# EAGLE design Schematic LED Board (EAGLE 9.2.1)
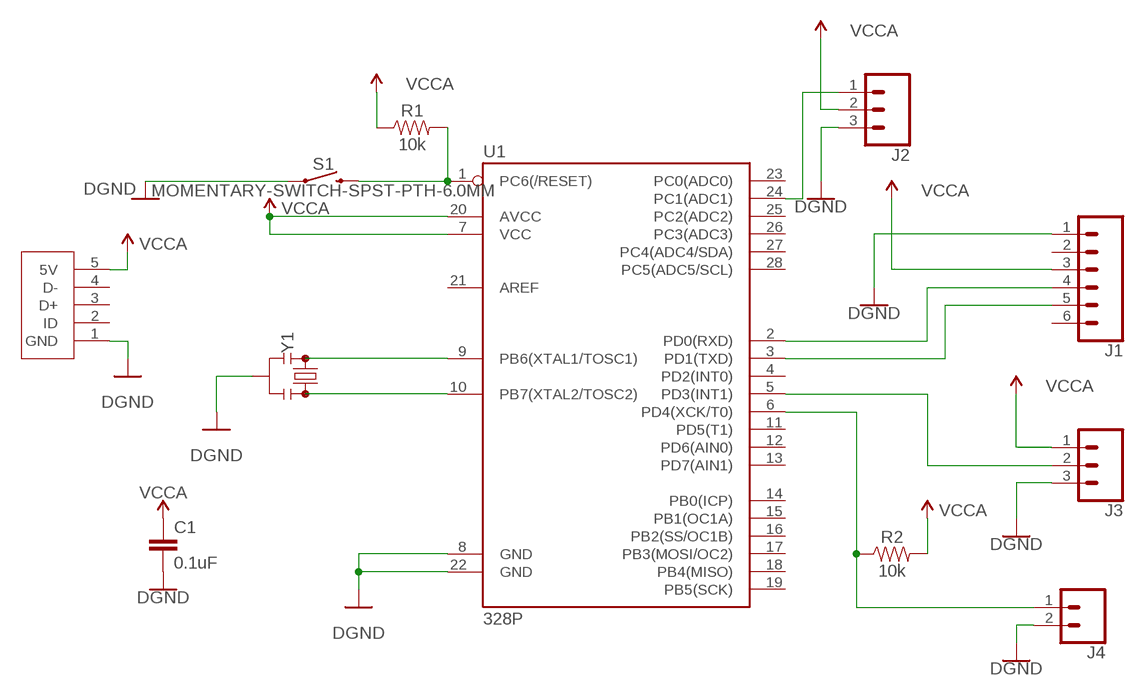
[diagram p0: schematic, sheet 1]

## Parts
C1  0.1uF  0.1UF-KIT-EZ-50V-20%  [CAP-PTH-SMALL-KIT]
J1  CONN_06LONGPADS  [1X06_LONGPADS]
J2  CONN_03LONGPADS  [1X03_LONGPADS]
J3  CONN_03LONGPADS  [1X03_LONGPADS]
J4  CONN_02PTH3  [1X02_LONGPADS]
R1  10k  10KOHM-HORIZ-1/6W-5%  [AXIAL-0.3]
R2  10k  10KOHM-HORIZ-1/6W-5%  [AXIAL-0.3]
S1  MOMENTARY-SWITCH-SPST-PTH-6.0MM  [TACTILE_SWITCH_PTH_6.0MM]
U1  328P  ATMEGA328P_PDIP  [DIP28]
U$8  USBPOWER  [1X05_LONGPADS]
Y1  RESONATORPTH-7.6X3.8  [RESONATOR-PTH-7.6X3.8]

## Nets
GND: C1.2 J1.1 J2.3 J3.3 J4.2 S1.1 U1.8(GND) U1.22(GND) U$8.1(GND) Y1.2 ; supply symbol labelled DGND
N$1: U1.9(PB6(XTAL1/TOSC1)) Y1.1
N$2: R1.P$2 S1.3 U1.1(PC6(/RESET))
N$3: U1.10(PB7(XTAL2/TOSC2)) Y1.3
N$4: J3.2 U1.5(PD3(INT1))
N$5: J1.4 U1.2(PD0(RXD))
N$6: J1.5 U1.3(PD1(TXD))
N$7: J2.1 U1.24(PC1(ADC1))
N$8: J4.1 R2.P$1 U1.6(PD4(XCK/T0))
VCCA: C1.1 J1.3 J2.2 J3.1 R1.P$1 R2.P$2 U1.7(VCC) U1.20(AVCC) U$8.5(5V)
Unconnected: J1.2 J1.6 U1.4(PD2(INT0)) U1.11(PD5(T1)) U1.12(PD6(AIN0)) U1.13(PD7(AIN1)) U1.14(PB0(ICP)) U1.15(PB1(OC1A)) U1.16(PB2(SS/OC1B)) U1.17(PB3(MOSI/OC2)) U1.18(PB4(MISO)) U1.19(PB5(SCK)) U1.21(AREF) U1.23(PC0(ADC0)) U1.25(PC2(ADC2)) U1.26(PC3(ADC3)) U1.27(PC4(ADC4/SDA)) U1.28(PC5(ADC5/SCL)) U$8.2(ID) U$8.3(D+) U$8.4(D-)

## Library data of the parts
C1 = Renata's Library:0.1UF: 0.1µF ceramic capacitors A capacitor is a passive two-terminal electrical component used to store electrical energy temporarily in an electric field.; PROD_ID: CAP-08370
J1 = Renata's Library:CONN_06: Multi connection point. Often used as Generic Header-pin footprint for 0.1 inch spaced/style header connections On any of the 0.1 inch spaced packages, you can populate with these: Break Away Headers - Straight <https://www.sparkfun.com/products/116> (PRT-00116) Break Away Male Headers - Right Angle <https://www.sparkfun.com/products/553> (PRT-00553) Female Headers <https://www.sparkfun.com/products/115> (PRT-00115) Break Away Headers - Machine Pin <https://www.sparkfun.com/products/117> (PRT-00117) Break Away Female Headers - Swiss Machine Pin <https://www.sparkfun.com/products/743> (PRT-00743) Arduino Stackable Header - 6 Pin <https://www.sparkfun.com/products/9280> (PRT-09280) For SCREWTERMINALS and SPRING TERMINALS visit here: Screw Terimnals on SparkFun.com <https://www.sparkfun.com/search/results?term=Screw+Terminals> (5mm/3.5mm/2.54mm spacing) This device is also useful as a general connection point to wire up your design to another part of your project. Our various solder wires solder well into these plated through hole pads. Hook-Up Wire - Assortment (Stranded, 22 AWG) <https://www.sparkfun.com/products/11375> (PRT-11375) Hook-Up Wire - Assortment (Solid Core, 22 AWG) <https://www.sparkfun.com/products/11367> (PRT-11367) View the entire wire category on our website here <https://www.sparkfun.com/categories/141>
J2 J3 = Renata's Library:CONN_03: Multi connection point. Often used as Generic Header-pin footprint for 0.1 inch spaced/style header connections On any of the 0.1 inch spaced packages, you can populate with these: Break Away Headers - Straight <https://www.sparkfun.com/products/116> (PRT-00116) Break Away Male Headers - Right Angle <https://www.sparkfun.com/products/553> (PRT-00553) Female Headers <https://www.sparkfun.com/products/115> (PRT-00115) Break Away Headers - Machine Pin <https://www.sparkfun.com/products/117> (PRT-00117) Break Away Female Headers - Swiss Machine Pin <https://www.sparkfun.com/products/743> (PRT-00743) Stackable Header - 3 Pin (Female, 0.1") <https://www.sparkfun.com/products/13875> (PRT-13875) For SCREWTERMINALS and SPRING TERMINALS visit here: Screw Terimnals on SparkFun.com <https://www.sparkfun.com/search/results?term=Screw+Terminals> (5mm/3.5mm/2.54mm spacing) This device is also useful as a general connection point to wire up your design to another part of your project. Our various solder wires solder well into these plated through hole pads. Hook-Up Wire - Assortment (Stranded, 22 AWG) <https://www.sparkfun.com/products/11375> (PRT-11375) Hook-Up Wire - Assortment (Solid Core, 22 AWG) <https://www.sparkfun.com/products/11367> (PRT-11367) View the entire wire category on our website here <https://www.sparkfun.com/categories/141> Special notes: Molex polarized connector foot print use with SKU : PRT-08232 with associated crimp pins and housings.
J4 = Renata's Library:CONN_02: Multi connection point. Often used as Generic Header-pin footprint for 0.1 inch spaced/style header connections On any of the 0.1 inch spaced packages, you can populate with these: Break Away Headers - Straight <https://www.sparkfun.com/products/116> (PRT-00116) Break Away Male Headers - Right Angle <https://www.sparkfun.com/products/553> (PRT-00553) Female Headers <https://www.sparkfun.com/products/115> (PRT-00115) Break Away Headers - Machine Pin <https://www.sparkfun.com/products/117> (PRT-00117) Break Away Female Headers - Swiss Machine Pin <https://www.sparkfun.com/products/743> (PRT-00743) For SCREWTERMINALS and SPRING TERMINALS visit here: Screw Terimnals on SparkFun.com <https://www.sparkfun.com/search/results?term=Screw+Terminals> (5mm/3.5mm/2.54mm spacing) This device is also useful as a general connection point to wire up your design to another part of your project. Our various solder wires solder well into these plated through hole pads. Hook-Up Wire - Assortment (Stranded, 22 AWG) <https://www.sparkfun.com/products/11375> (PRT-11375) Hook-Up Wire - Assortment (Solid Core, 22 AWG) <https://www.sparkfun.com/products/11367> (PRT-11367) View the entire wire category on our website here <https://www.sparkfun.com/categories/141> Special notes: Molex polarized connector foot print use with: PRT-08233 with associated crimp pins and housings. 2.54_SCREWTERM for use with PRT-10571. 3.5mm Screw Terminal footprints for PRT-08084 5mm Screw Terminal footprints for use with PRT-08432
R1 R2 = Renata's Library:10KOHM: 10kΩ resistor A resistor is a passive two-terminal electrical component that implements electrical resistance as a circuit element. Resistors act to reduce current flow, and, at the same time, act to lower voltage levels within circuits. - Wikipedia; PROD_ID: RES-08375
S1 = Renata's Library:MOMENTARY-SWITCH-SPST: Momentary Switch (Pushbutton) - SPST Normally-open (NO) SPST momentary switches (buttons, pushbuttons). Variants PTH-12MM - 12mm square, through-hole Momentary Pushbutton Switch - 12mm Square <https://www.sparkfun.com/products/9190> (COM-09190) PTH-6.0MM, PTH-6.0MM-KIT - 6.0mm square, through-hole Mini Pushbutton Switch <https://www.sparkfun.com/products/97> (COM-00097) KIT package intended for soldering kit's - only one side of pads' copper is exposed. PTH-RIGHT-ANGLE-KIT - Right-angle, through-hole Right Angle Tactile Button <https://www.sparkfun.com/products/10791> - Used on SparkFun BigTime Watch Kit <https://www.sparkfun.com/products/11734> SMD-12MM - 12mm square, surface-mount Tactile Button - SMD (12mm) <https://www.sparkfun.com/products/12993> (COM-12993) Used on SparkFun PicoBoard <https://www.sparkfun.com/products/11888> SMD-4.5MM - 4.5mm Square Trackball Switch Used on SparkFun Blackberry Trackballer Breakout <https://www.sparkfun.com/products/13169> SMD-4.6MMX2.8MM - 4.60mm x 2.80mm, surface mount Used on SparkFun SAMD21 Mini Breakout <https://www.sparkfun.com/products/13664> SMD-5.2MM, SMD-5.2-REDUNDANT - 5.2mm square, surface-mount Mini Pushbutton Switch - SMD <https://www.sparkfun.com/products/8720> (COM-08720) Used on Arduino Pro Mini <https://www.sparkfun.com/products/11114> REDUNDANT package connects both switch circuits together SMD-6.0X3.5MM - 6.0 x 3.5mm, surface mount Momentary Reset Switch SMD <https://www.sparkfun.com/products/8229> (COM-08229) SMD-6.2MM-TALL - 6.2mm square, surface mount Tactile Button - SMD (6mm) <https://www.sparkfun.com/products/12992> Used on SparkFun Digital Sandbox <https://www.sparkfun.com/products/12651> SMD-RIGHT-ANGLE - Right-angle, surface mount Used on SparkFun Block for Intel® Edison - Arduino <https://www.sparkfun.com/products/13036>; PROD_ID: SWCH-08441; SF_SKU: COM-00097
U1 = Renata's Library:ATMEGA328P_PDIP: Atmel 328P Through hole ATMEGA328P uC used in the Arduino 32kb flash, 1k EEPROM, 2k SRAM Datasheet <http://www.sparkfun.com/datasheets/Components/SMD/ATMega328.pdf> SparkFun Products Storefront component: AVR 28 Pin 20MHz 32K 6A/D - ATMega328P <https://www.sparkfun.com/products/9061> (COM-09061) SparkFun Simon Says - Through-Hole Soldering Kit <https://www.sparkfun.com/products/10547> (KIT-10547) SparkFun Learn to Solder - Simon Says <https://www.sparkfun.com/products/13708> (KIT-13708) SparkFun BigTime Watch Kit <https://www.sparkfun.com/products/11734> (KIT-11734) SparkFun ClockIt <https://www.sparkfun.com/products/10930> (KIT-10930) SparkFun Serial Enabled LCD Kit <https://www.sparkfun.com/products/10097> (LCD-10097) SparkFun Simon Tilts - Through Hole Soldering Kit <https://www.sparkfun.com/products/12634> (KIT-12634) SparkFun Frequency Counter Kit <https://www.sparkfun.com/products/10140> (KIT-10140) FabFM Radio Kit <https://www.sparkfun.com/products/11043> (KIT-11043) SparkFun Binary Blaster Kit <https://www.sparkfun.com/products/12037> (KIT-12037) SparkFun Metro-Gnome <https://www.sparkfun.com/products/9236> (KIT-09236) ATmega328 with Arduino Optiboot (Uno) <https://www.sparkfun.com/products/10524> (DEV-10524); PROD_ID: IC-09136
U$8 = Renata's Library:USBPOWER
Y1 = Renata's Library:RESONATOR: Resonators (Generic) Ceramic resonators are clock-generating components, often used to control timing in microcontrollers. They usually have 3 pins: two pins for oscillation, and one pin for ground. Compared to crystals, resonators have worse tolerance, but are usually much cheaper. Plus, they have built-in load capacitors! These devices are used on boards like the Arduino Pro 8MHz <https://www.sparkfun.com/products/11114> and Arduino Pro 16MHz <https://www.sparkfun.com/products/11113>.

## Net classes
0 default: width 0.457 mm, drill 0.457 mm, clearance 0.457 mm

## Board
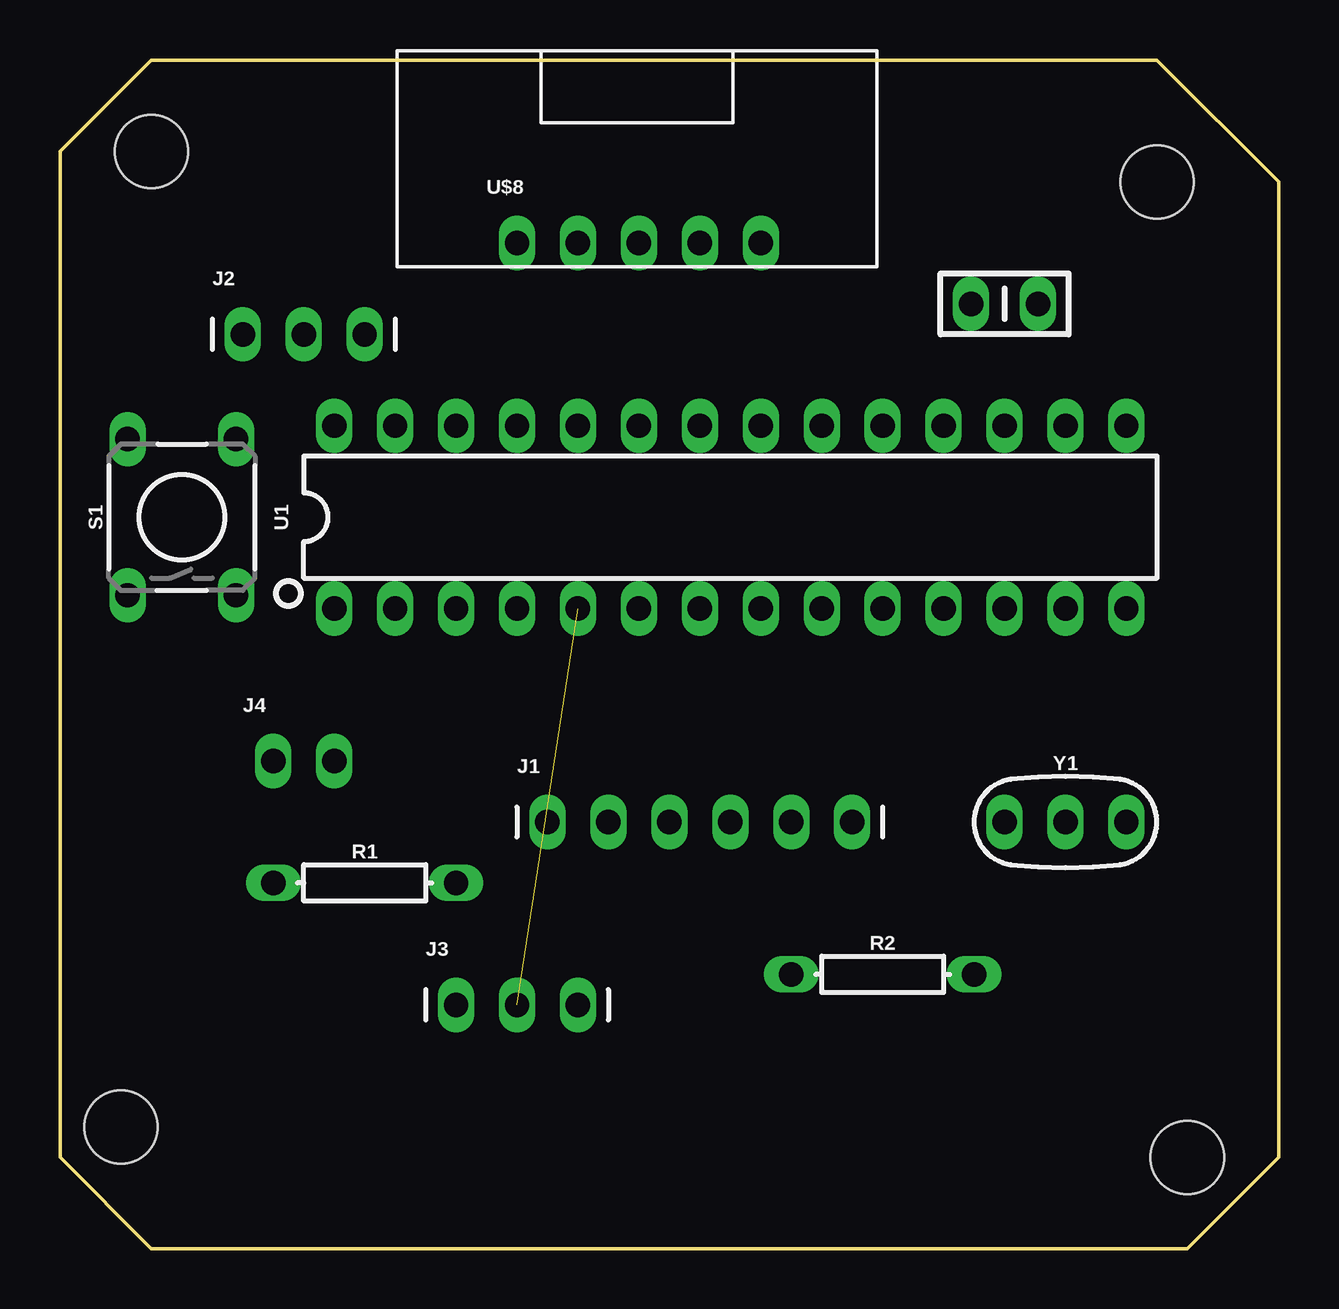
[diagram p1: board, top side]
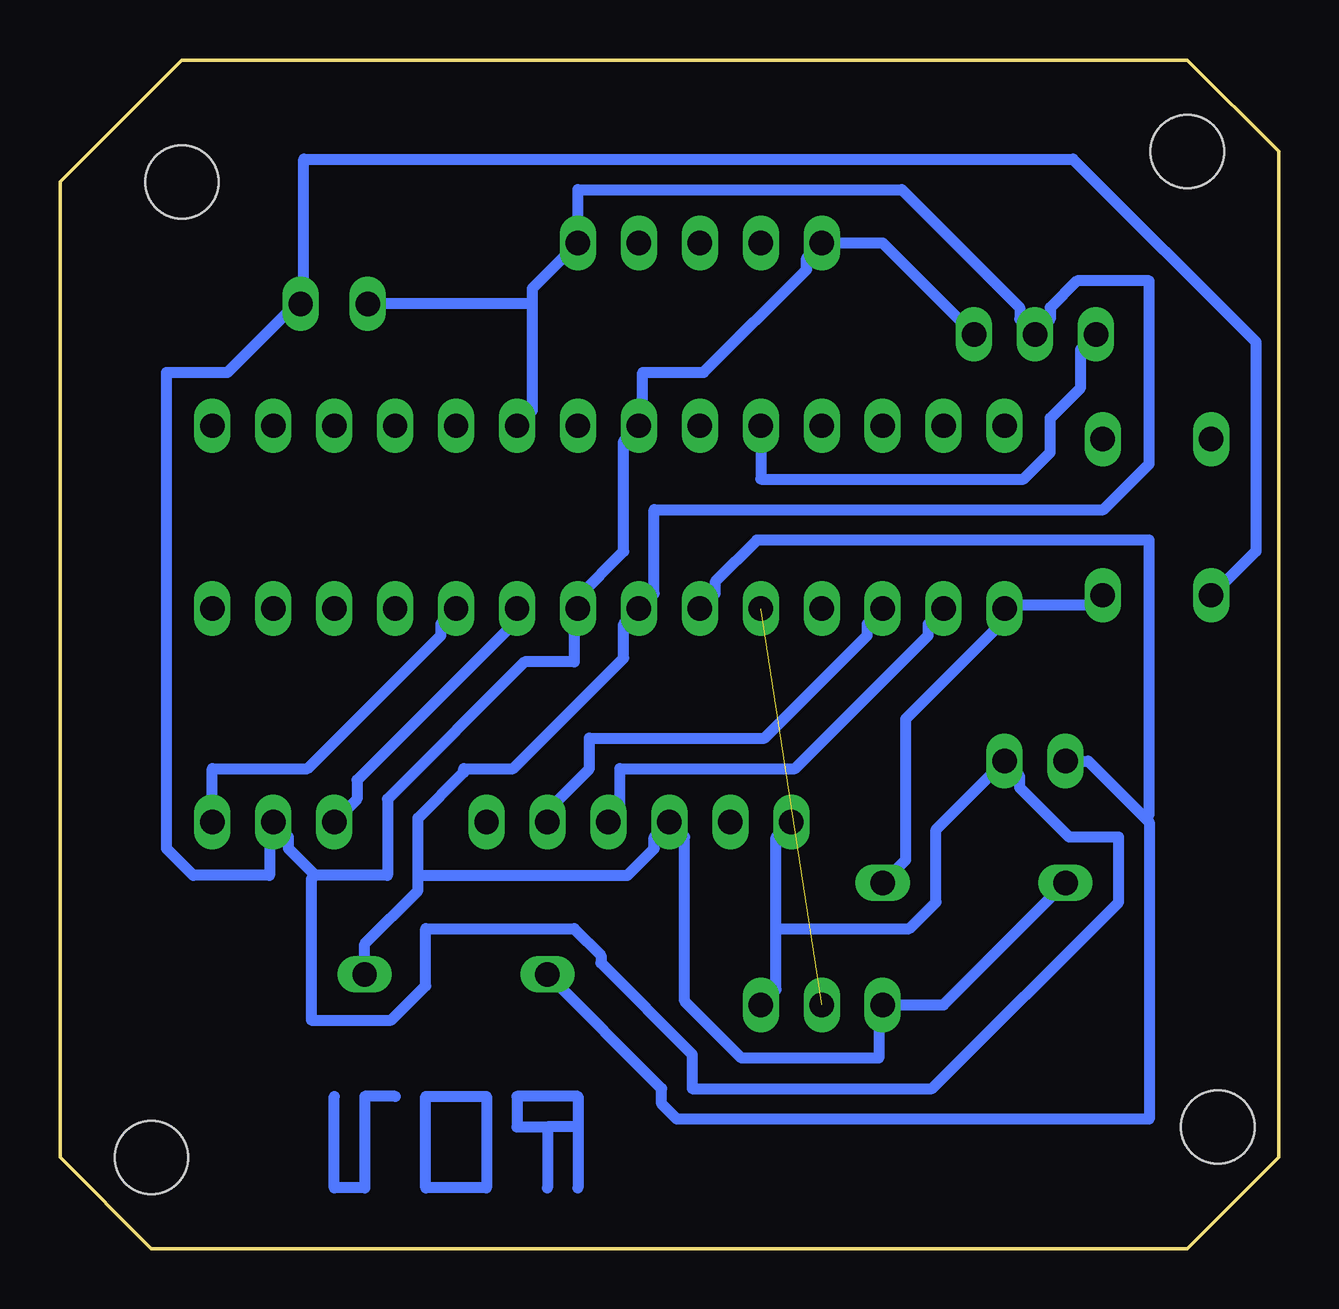
[diagram p2: board, bottom side, seen from below]

Size 50.8 x 49.53 mm. Coordinates in mm from the lower left corner, seen from the top.
Outline: 46.99,0 3.81,0 0,3.81 0,45.72 3.81,49.53 45.72,49.53 50.8,44.45 50.8,3.81 46.99,0
Copper layers (1*16): Top 0.035mm / dielectric 1.5mm / Bottom 0.035mm
Design rules "OthermillDRC_1_32_v2": minimum track width 8mil, minimum drill 0.8mm, track to track 0.794003125mm, track to pad 0.794003125mm, pad to pad 0.794003125mm, via to via 0.794003125mm, smd to smd 0mil, copper to edge 0mil, drill to drill 1mil, minimum pad ring 10mil, minimum via ring 10mil, stop-mask expansion 1mil, vias tented up to drill 30mil, thermal gap 10mil
Holes 3.05 mm at 3.81,45.72 45.72,44.45 46.99,3.81 2.54,5.08

### Footprints (pad centres in the part's own frame; a part is rotated, then mirrored left to right if it is on the bottom)
CAP-PTH-SMALL-KIT = drill 1.016 long: 1 -1.397,0; 2 1.397,0
1X06_LONGPADS = drill 1.016 long: 1 0,0; 2 2.54,0; 3 5.08,0; 4 7.62,0; 5 10.16,0; 6 12.7,0
1X03_LONGPADS = drill 1.016 long: 1 0,0; 2 2.54,0; 3 5.08,0
1X02_LONGPADS = drill 1.016 long: 1 0,0; 2 2.54,0
AXIAL-0.3 = drill 1.016 long: P$1 -3.81,0; P$2 3.81,0
TACTILE_SWITCH_PTH_6.0MM = drill 1.016 long: 1 -3.251,2.261; 2 3.251,2.261; 3 -3.251,-2.261; 4 3.251,-2.261
DIP28 = drill 1.016 long: 1 -16.51,-3.81; 2 -13.97,-3.81; 3 -11.43,-3.81; 4 -8.89,-3.81; 5 -6.35,-3.81; 6 -3.81,-3.81; 7 -1.27,-3.81; 8 1.27,-3.81; 9 3.81,-3.81; 10 6.35,-3.81; 11 8.89,-3.81; 12 11.43,-3.81; 13 13.97,-3.81; 14 16.51,-3.81; 15 16.51,3.81; 16 13.97,3.81; 17 11.43,3.81; 18 8.89,3.81; 19 6.35,3.81; 20 3.81,3.81; 21 1.27,3.81; 22 -1.27,3.81; 23 -3.81,3.81; 24 -6.35,3.81; 25 -8.89,3.81; 26 -11.43,3.81; 27 -13.97,3.81; 28 -16.51,3.81
1X05_LONGPADS = drill 1.016 long: 1 0,0; 2 2.54,0; 3 5.08,0; 4 7.62,0; 5 10.16,0
RESONATOR-PTH-7.6X3.8 = drill 1.016 long: 1 -2.54,0; 2 0,0; 3 2.54,0

### Placement (x,y rotation side)
C1  39.37,39.37 0 top
J1  20.32,17.78 0 top
J2  7.62,38.1 0 top
J3  16.51,10.16 0 top
J4  8.89,20.32 0 top
R1  12.7,15.24 0 top
R2  34.29,11.43 0 top
S1  5.08,30.48 90 top
U1  27.94,30.48 0 top
U$8  19.05,41.91 0 top
Y1  41.91,17.78 0 top

### Tracks (layer width: path | path; a pad name or v marks a point on that pad's centre or on a via)
GND
  Bottom 0.457: S1.1 2.7,27.3 0.95,29.05 0.95,37.78 8.57,45.4 40.64,45.4 40.64,39.37 C1.2 40.96,39.37 43.81,36.51 46.35,36.51 46.35,16.67 45.24,15.56 42.07,15.56 42.07,17.62 Y1.2 41.27,17.14 41.27,16.67 40.16,15.56 | J1.1 20.95,17.14 20.95,13.34 | 20.95,13.34 20.95,10.79 J3.3 | 20.95,13.34 15.4,13.34 14.29,14.45 14.29,17.46 J4.2 10.79,19.68 10.79,19.21 8.73,17.14 6.67,17.14 6.67,14.45 14.45,6.67 24.45,6.67 24.45,8.1 28.26,11.91 28.26,12.22 29.37,13.34 35.56,13.34 35.56,10.95 36.99,9.53 40.32,9.53 40.32,15.4 40.16,15.56 | J2.3 16.51,41.91 U$8.1 19.68,41.27 19.68,40.8 23.97,36.51 26.51,36.51 26.51,34.45 U1.22 27.3,33.66 27.3,29.05 29.21,27.15 U1.8 29.37,26.51 29.37,24.45 31.43,24.45 37.15,18.73 37.15,15.56 40.16,15.56
N$1
  Bottom 0.457: Y1.1 38.42,18.73 38.42,19.53 31.75,26.19 U1.9
N$2
  Bottom 0.457: R1.P$2 15.56,16.19 15.56,22.07 11.43,26.19 U1.1 11.27,26.83 7.78,26.83 7.46,27.15 S1.3
N$3
  Bottom 0.457: U1.10 34.92,26.04 34.92,25.56 40.48,20 44.45,20 Y1.3
N$4  (1 unrouted)
N$5
  Bottom 0.457: U1.2 14.61,26.04 14.61,25.56 20.16,20 27.46,20 27.46,18.26 J1.4
N$6
  Bottom 0.457: U1.3 17.14,26.04 17.14,25.56 21.43,21.27 28.73,21.27 28.73,20 30.48,18.26 J1.5
N$7
  Bottom 0.457: J2.1 8.26,37.47 8.26,35.88 9.53,34.61 9.53,33.18 10.64,32.07 21.59,32.07 U1.24
N$8
  Bottom 0.457: R2.P$1 25.72,6.67 25.72,6.03 25.08,5.4 5.4,5.4 5.4,17.78 5.56,17.94 | 5.56,17.94 7.94,20.32 J4.1 | U1.6 23.5,27.3 23.5,27.78 21.75,29.53 5.4,29.53 5.4,18.1 5.56,17.94
N$9
  Bottom 0.457: 29.21,5.08 29.21,6.35 31.75,6.35 31.75,5.08 30.48,5.08 | 29.21,5.08 30.48,5.08 | 30.48,5.08 30.48,2.54 | 29.21,5.08 29.21,2.54
N$10
  Bottom 0.457: 33.02,6.35 33.02,2.54 35.56,2.54 35.56,6.35 33.02,6.35
N$11
  Bottom 0.457: 36.83,6.35 38.1,6.35 38.1,2.54 39.37,2.54 39.37,6.35
VCCA
  Bottom 0.457: U1.20 31.11,34.92 31.11,39.37 | 31.11,39.37 31.11,40.01 U$8.5 29.21,44.13 15.72,44.13 10.79,39.21 10.79,38.73 J2.2 9.53,38.73 9.53,39.21 8.41,40.32 5.4,40.32 5.4,32.7 7.3,30.8 26.04,30.8 26.04,27.3 U1.7 27.3,26.04 27.3,24.61 31.91,20 33.97,20 33.97,19.84 35.88,17.94 35.88,15.56 | 31.11,39.37 C1.1 | R1.P$1 13.97,10.16 J3.1 16.67,10 16.67,7.94 22.38,7.94 24.77,10.32 24.77,17.14 J1.3 26.04,17.14 26.04,16.67 27.15,15.56 35.88,15.56 | 35.88,15.56 35.88,14.92 38.1,12.7 R2.P$2